# EasyEDA Pro project PRJ_Feeder_V01c.epro, schematic Feeder

## Sheets
1 MCU: Board Name: Feeder; Create Date: 2025-04-08; Page Name: MCU; Project Name: Orion-Feeder; Schematic Name: Feeder; Update Date: 2025-04-08; Company: EasyEDA.com; Drawn: Cesarotto G.; Page Size: A4; Version: V0.2a
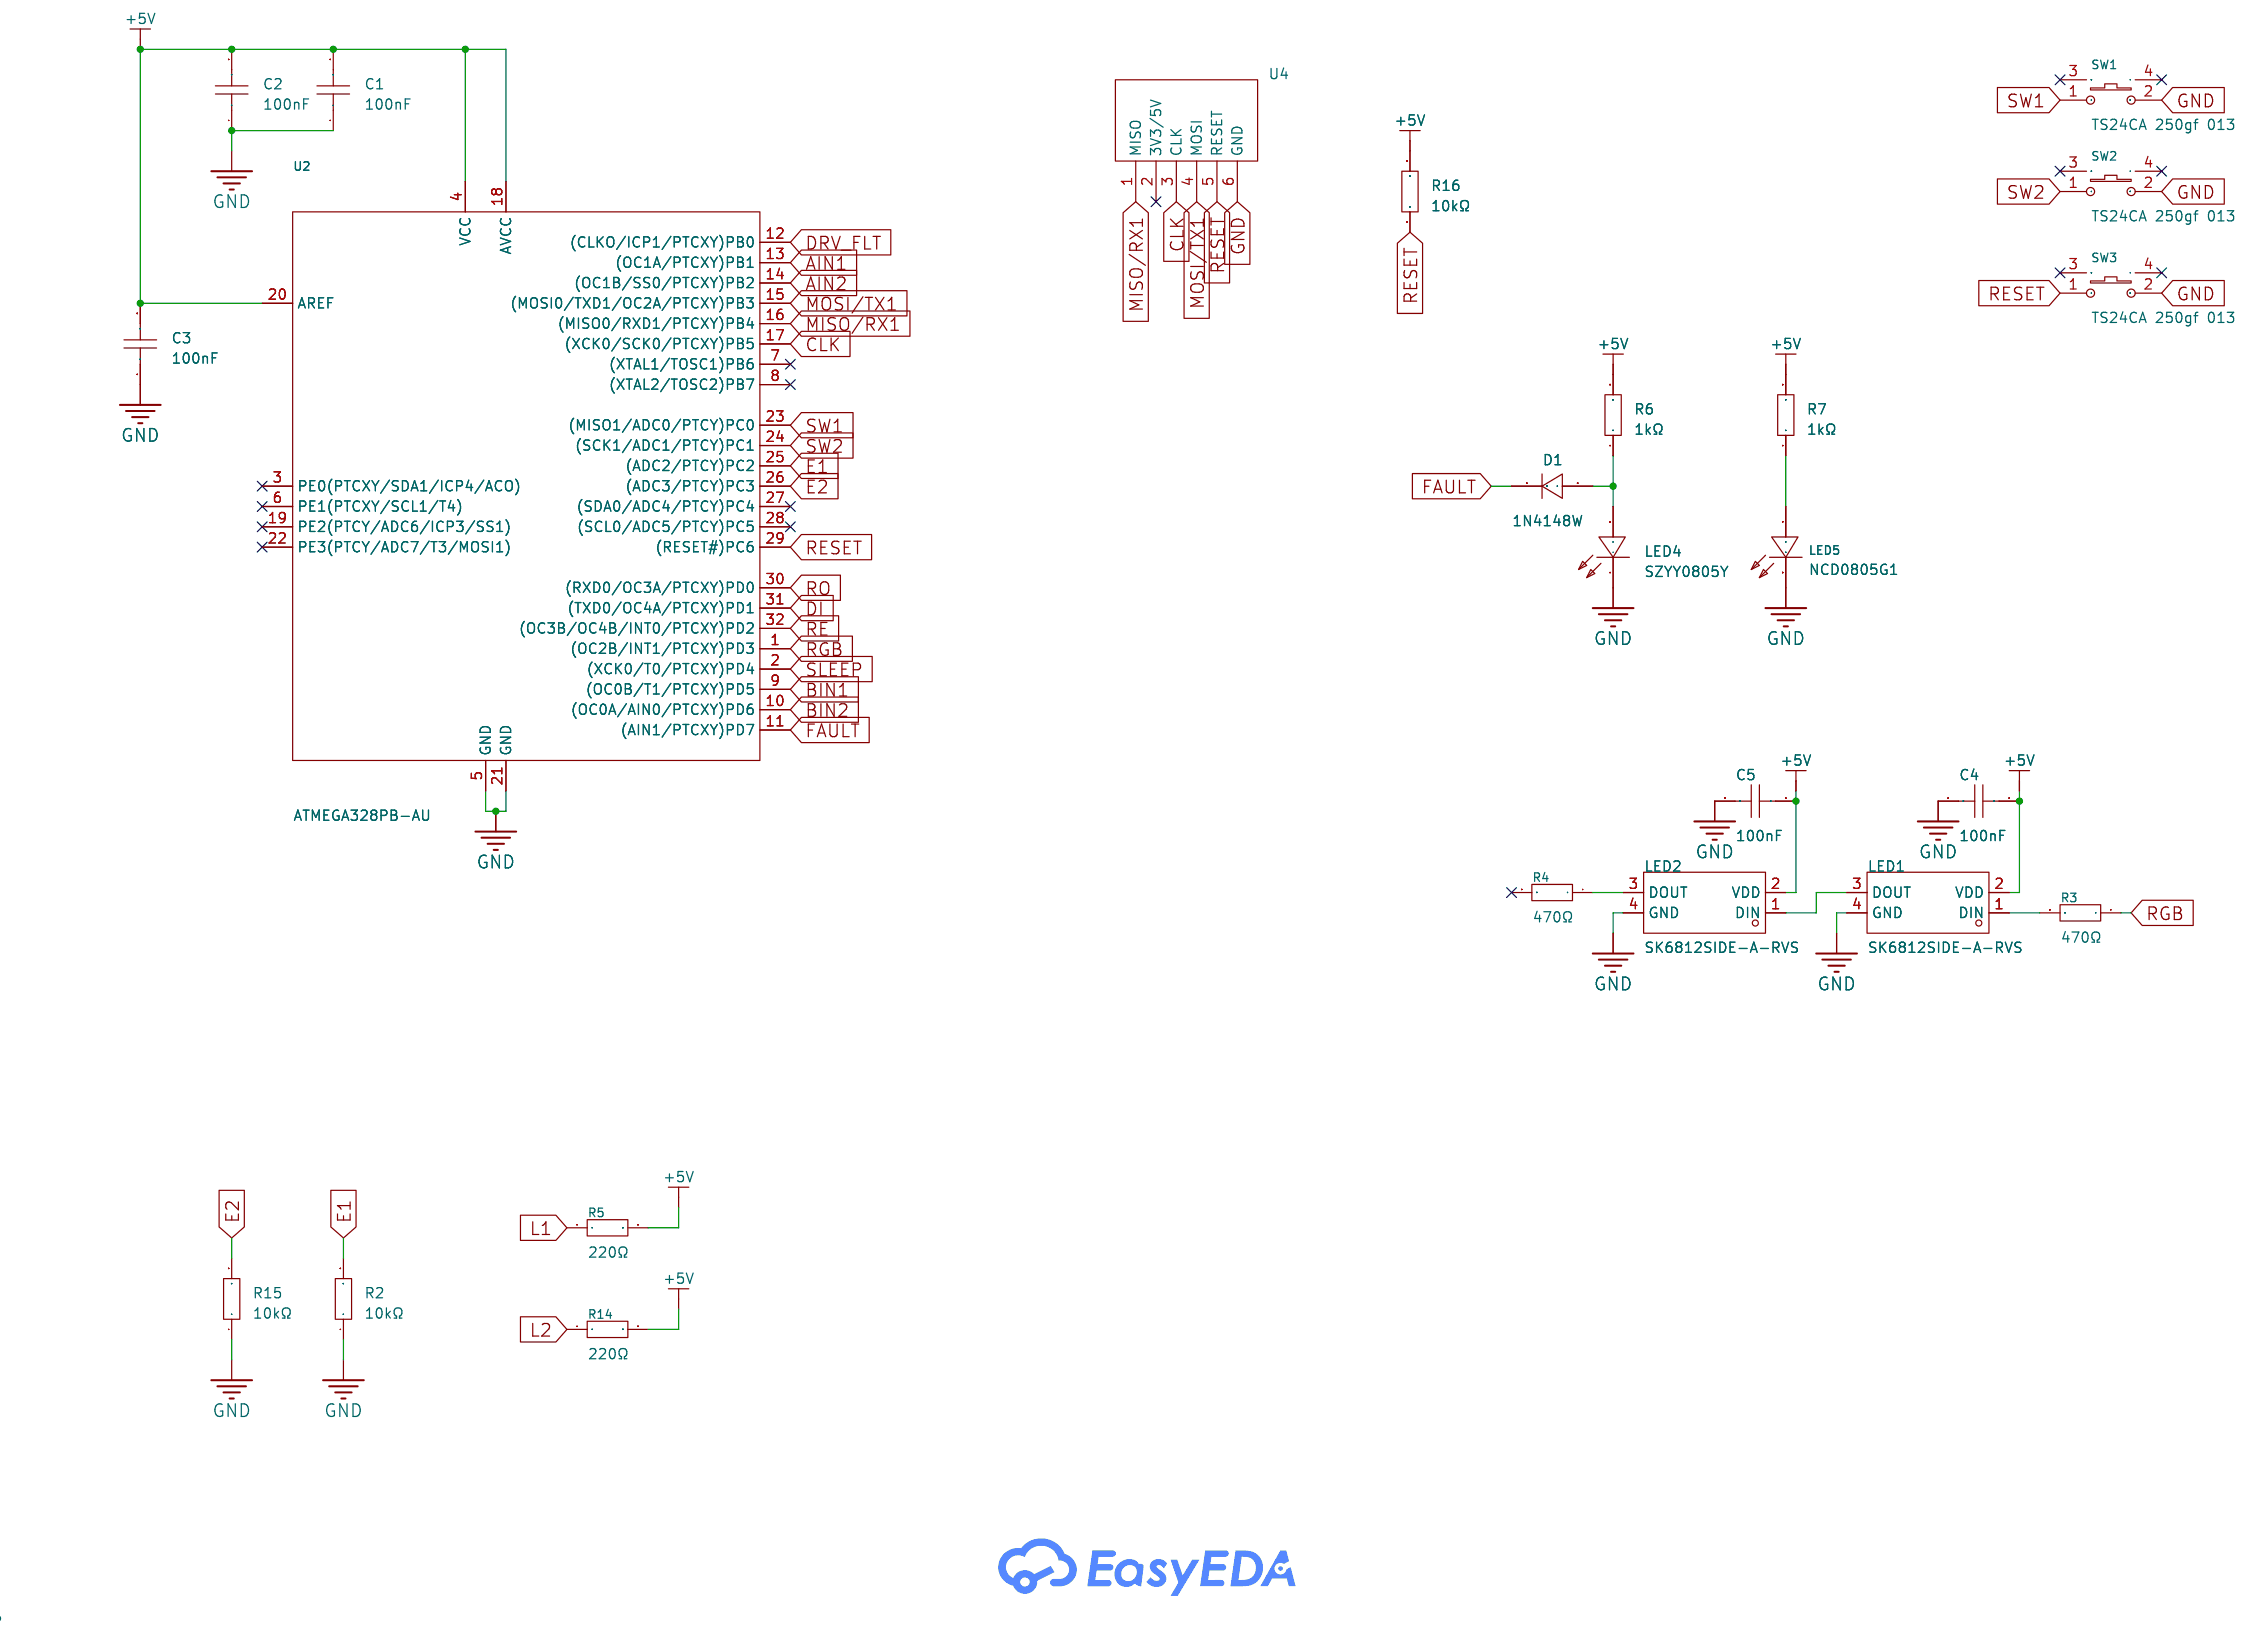
[diagram p5: MCU]
2 Power: Page Name: Power
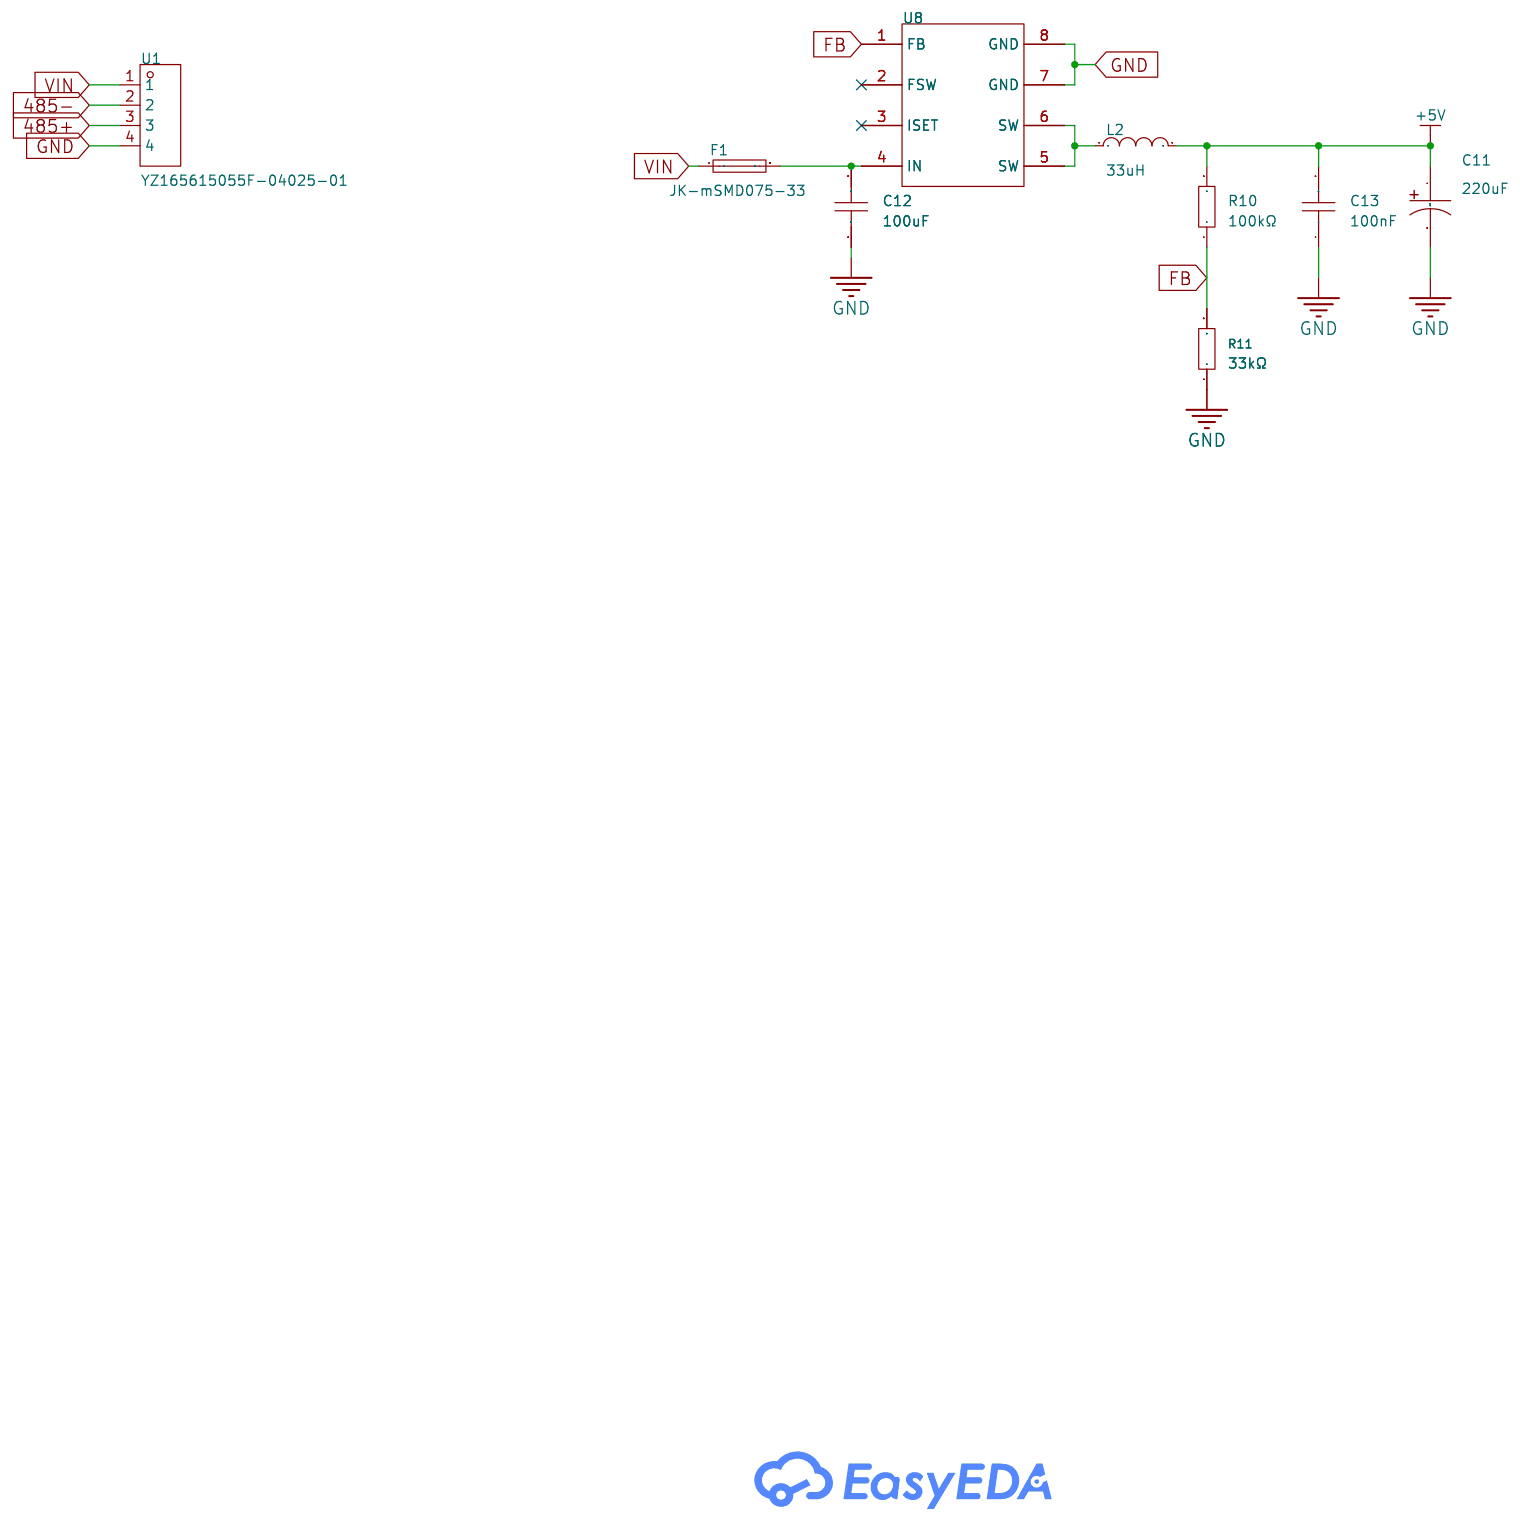
[diagram p6: Power]
3 Motor: Page Name: Motor; Update Date: 2025-04-09
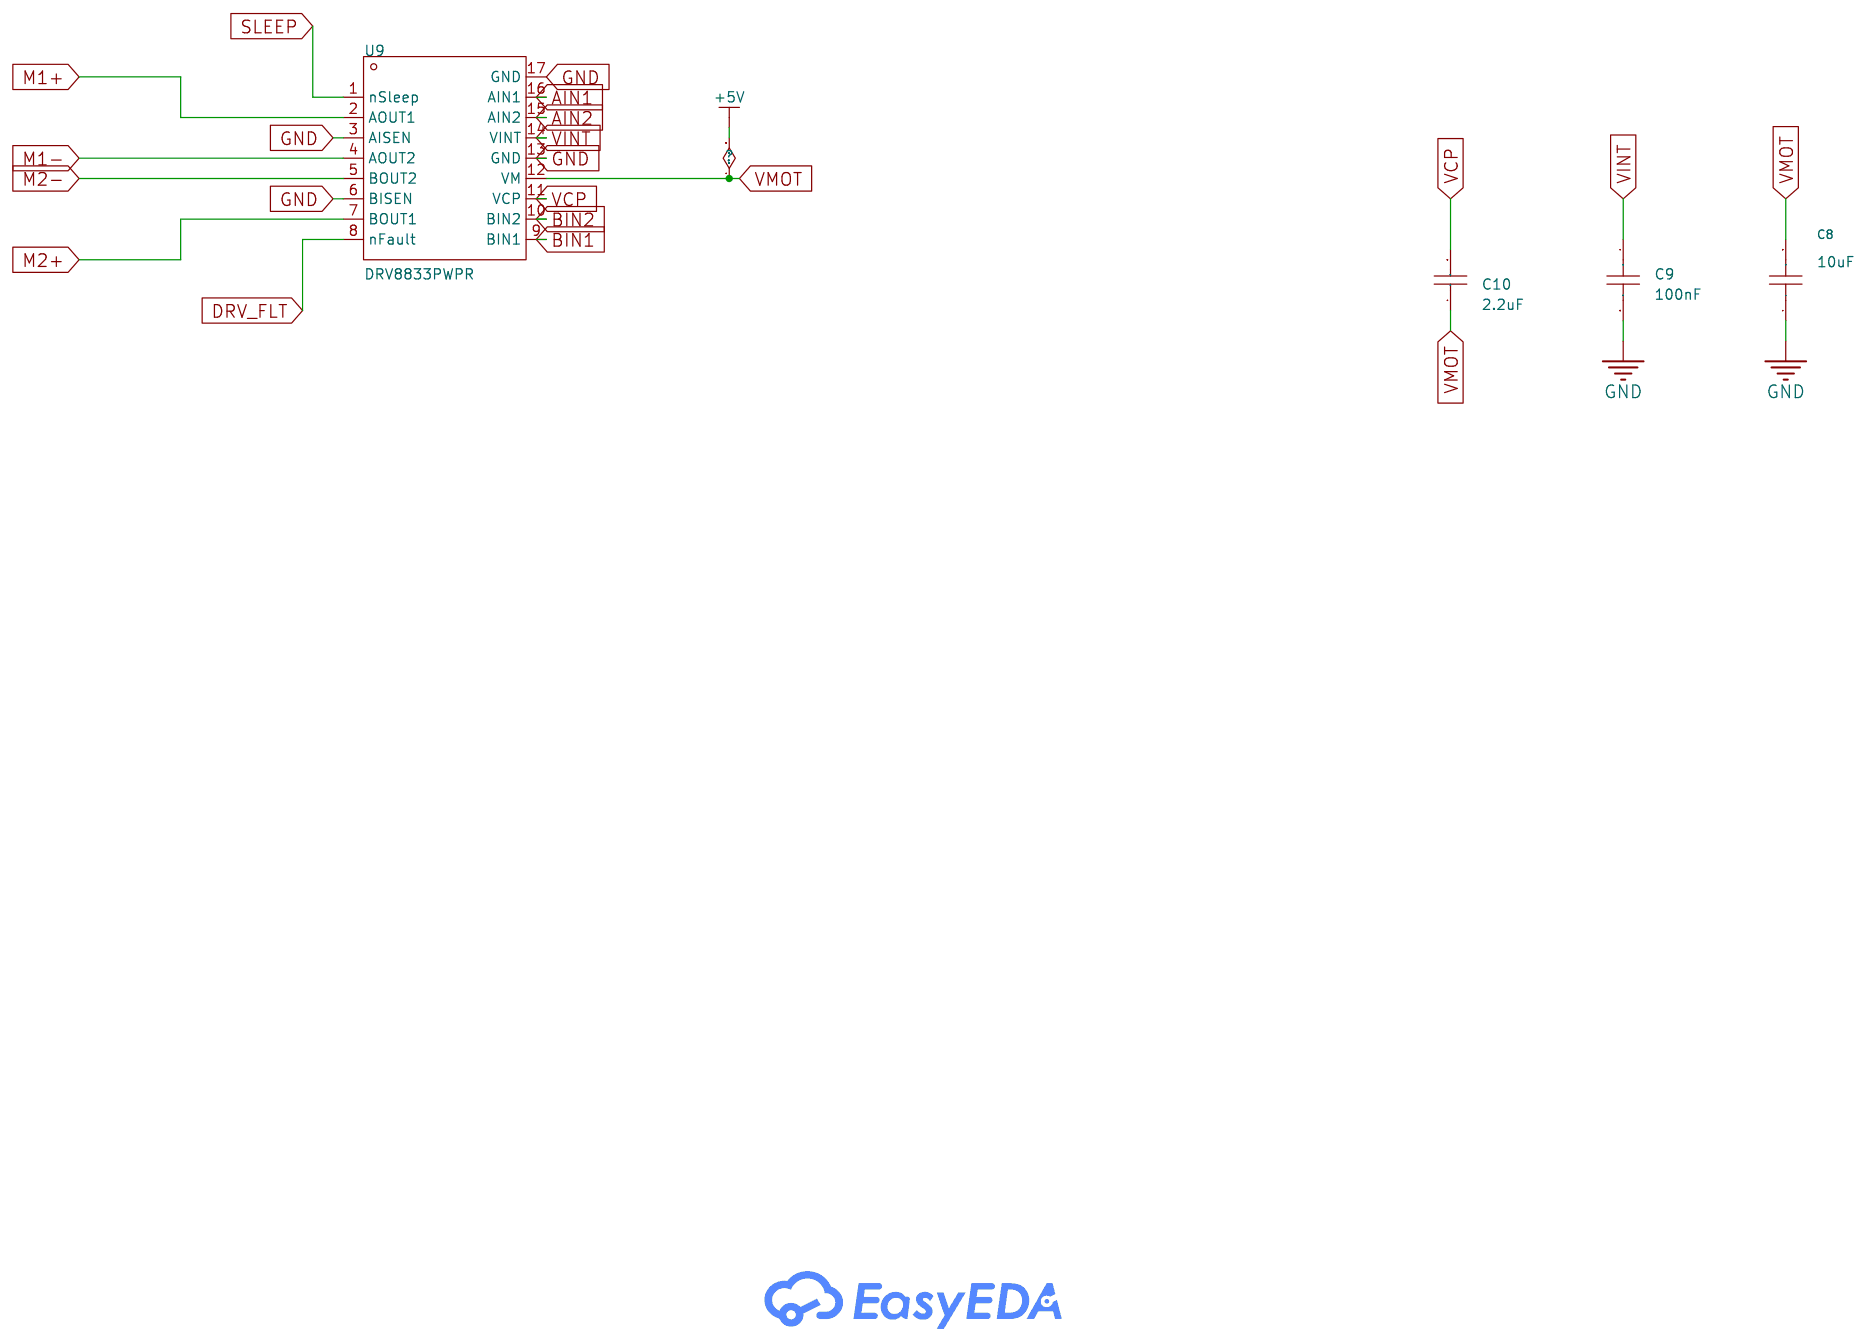
[diagram p7: Motor]
4 Serial: Page Name: Serial; Update Date: 2025-04-15; Version: V0.2b
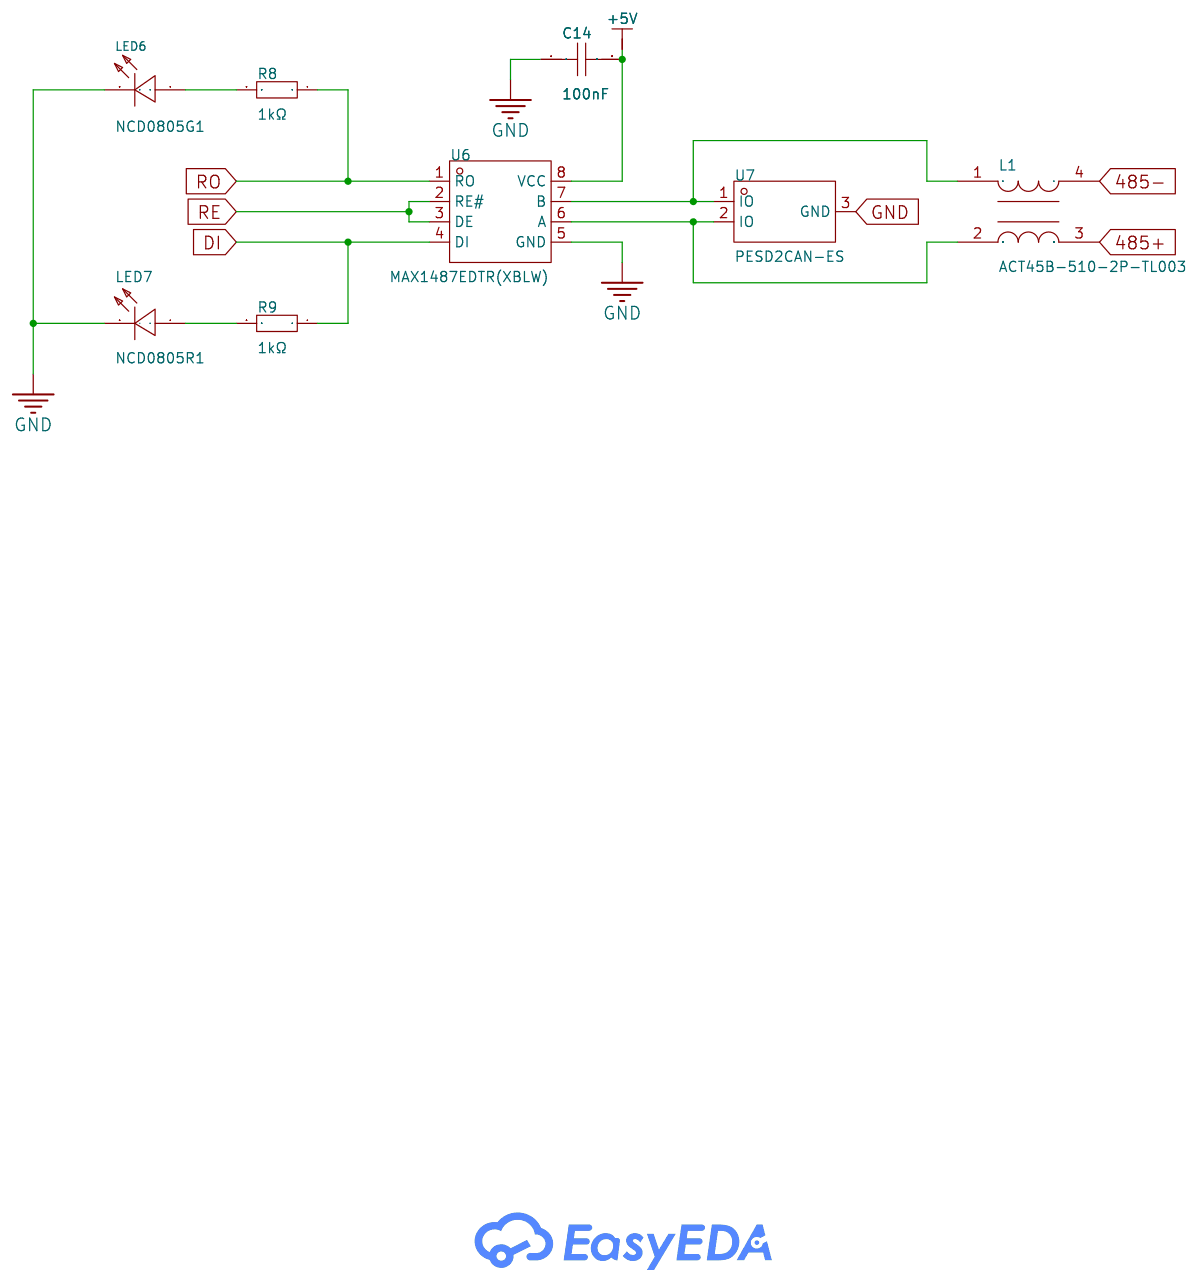
[diagram p8: Serial]

## Parts
sheet MCU
C1  100nF  [C0805]
C2  100nF  [C0805]
C3  100nF  [C0805]
C4  100nF  [C0805]
C5  100nF  [C0805]
D1  1N4148W  [SOD-123_L2.8-W1.8-LS3.7-RD]
LED1  SK6812SIDE-A-RVS  [LED-SMD_4P-L4.0-W1.6-L]
LED2  SK6812SIDE-A-RVS  [LED-SMD_4P-L4.0-W1.6-L]
LED4  SZYY0805Y  [LED0805-RD_YELLOW]
LED5  NCD0805G1  [LED0805-R-RD]
R2  10kΩ  [R0805]
R3  470Ω  [R0805]
R4  470Ω  [R0805]
R5  220Ω  [R0805]
R6  1kΩ  [R0805]
R7  1kΩ  [R0805]
R14  220Ω  [R0805]
R15  10kΩ  [R0805]
R16  10kΩ  [R0805]
SW1  TS24CA 250gf 013  [SW-SMD_L4.7-W3.5-P3.35-EH]
SW2  TS24CA 250gf 013  [SW-SMD_L4.7-W3.5-P3.35-EH]
SW3  TS24CA 250gf 013  [SW-SMD_L4.7-W3.5-P3.35-EH]
U2  ATMEGA328PB-AU  [TQFP-32_L7.0-W7.0-P0.80-LS9.0-BL]
U4  -  [HDR-M-2.54_1X6]
sheet Motor
C8  10uF  [C0805]
C9  100nF  [C0805]
C10  2.2uF  [C0805]
U9  DRV8833PWPR  [TSSOP-16_L5.0-W4.4-P0.65-LS6.4-BL-EP]
sheet Power
C11  220uF  [CAP-SMD_L7.3-W4.3-FD]
C12  100uF  [C1210]
C13  100nF  [C0805]
F1  JK-mSMD075-33  [F1812]
L2  33uH  [IND-SMD_L7.1-W6.6_SRP6030VA]
R10  100kΩ  [R0805_NEW]
R11  33kΩ  [R0805]
U1  YZ165615055F-04025-01  [CONN-SMD_4P-L11.0-W5.5-P2.50_YZ165615055F-04025-01]
U8  -  [SOP-8_L4.9-W3.9-P1.27-LS6.0-TR]
sheet Serial
C14  100nF  [C0805]
L1  ACT45B-510-2P-TL003  [IND-SMD_4P-L4.5-W3.2-TL]
LED6  NCD0805G1  [LED0805-R-RD]
LED7  NCD0805R1  [LED0805-R-RD]
R8  1kΩ  [R0805]
R9  1kΩ  [R0805]
U6  MAX1487EDTR(XBLW)  [SOP-8_L4.9-W3.9-P1.27-LS6.0-BL]
U7  PESD2CAN-ES  [SOT-23-3_L2.9-W1.3-P1.90-LS2.4-BR]

## Library data of the parts
C1-C5 C9 C13 C14 = CC0805KRX7R9BB104: Capacitance: Tolerance:±10% Tolerance:±10% Voltage Rated: Temperature Coefficient:; LCSC Part Name: 100nF ±10% 50V; Supplier Part: C49678; Manufacturer: YAGEO(国巨); Supplier Footprint: 0805; JLCPCB Part Class: Basic Part; Datasheet: https://atta.szlcsc.com/upload/public/pdf/source/20180224/C181747_15194369449651363981.pdf; Supplier: LCSC; Tolerance: ±10%
D1 = 1N4148W_C84367: Diode Configuration: Forward Voltage (Vf@If):1.5V@300mA Reverse Voltage (Vr): Rectified Current: Reverse Leakage Current:25nA@20V Reverse Recovery Time (trr): Operating Temperature:- Operating Temperature:-; LCSC Part Name: 电压:100V 电流:300mA; Supplier Part: C84367; Manufacturer: MDD(辰达半导体); Supplier Footprint: SOD-123; JLCPCB Part Class: Extended Part; Datasheet: https://atta.szlcsc.com/upload/public/pdf/source/20230823/B01BF36E6140A0359364F9F682D146D6.pdf; Supplier: LCSC; Forward Voltage (Vf@If): 1.5V@300mA; Reverse Leakage Current: 25nA@20V
LED1 LED2 = SK6812SIDE-A-RVS: LCSC Part Name: RGB三色; Supplier Part: C2890037; Manufacturer: 欧思科光电; Supplier Footprint: SMD,2x4mm; JLCPCB Part Class: Extended Part; Datasheet: https://atta.szlcsc.com/upload/public/pdf/source/20210825/5EE39C41748E35606331A2C5A4C913B6.pdf; Supplier: LCSC
LED4 = SZYY0805Y: Emitted Color:Yellow Power Dissipation:40mW Forward Current:10mA Dominant Wavelength:584nm~594nm Dominant Wavelength:584nm~594nm Peak Wavelength:596nm Diode Configuration:- Lens Color:无色透明透镜 Color Temperature:- Color Temperature:- Viewing Angle:120° Mount; LCSC Part Name: 黄灯; Supplier Part: C434436; Manufacturer: yongyu(永裕光电); Supplier Footprint: 0805; JLCPCB Part Class: Extended Part; Datasheet: https://atta.szlcsc.com/upload/public/pdf/source/20191204/C434436_DD3F69F670EA5C3EF8F92D3BC1EA8D03.pdf; Supplier: LCSC; Emitted Color: Yellow; Power Dissipation: 40mW; Forward Current: 10mA; Dominant Wavelength: 584nm~594nm; Peak Wavelength: 596nm; Lens Color: 无色透明透镜; Viewing Angle: 120°; Operating Temperature: -40℃~+85℃
LED5 LED6 = NCD0805G1: Emitted Color:Emerald Forward Voltage (VF):2.5V~3.6V Forward Voltage (VF):2.5V~3.6V Power Dissipation:72mW Forward Current:5mA Dominant Wavelength:525nm~537.5nm Dominant Wavelength:525nm~537.5nm Lens Color:无色透明透镜 Luminous Intensity:180mcd~400mcd Luminous; Supplier Part: C84260; Manufacturer: 国星光电; Supplier Footprint: 0805; JLCPCB Part Class: Extended Part; Datasheet: https://atta.szlcsc.com/upload/public/pdf/source/20200820/C84260_AFC7BF57C6FBA034D182BB8D10A67EFE.pdf; Supplier: LCSC; Emitted Color: Emerald; Forward Voltage (VF): 2.5V~3.6V; Power Dissipation: 72mW; Forward Current: 5mA; Dominant Wavelength: 525nm~537.5nm; Lens Color: 无色透明透镜; Luminous Intensity: 180mcd~400mcd; Viewing Angle: 130°; Operating Temperature: -30℃~+85℃
R2 R15 R16 = 0805W8F1002T5E: Type:Thick Film Resistors Resistance:10kΩ Tolerance:±1% Tolerance:±1% Power(Watts): Overload Voltage (Max): Temperature Coefficient:±100ppm/℃ Temperature Coefficient:±100ppm/℃ Operating Temperature Range:-55℃~+155℃ Operating Temperature Range:-55℃~+155℃; LCSC Part Name: 10kΩ ±1% 125mW 厚膜电阻; Supplier Part: C17414; Manufacturer: UNI-ROYAL(厚声); Supplier Footprint: 0805; JLCPCB Part Class: Basic Part; Datasheet: https://atta.szlcsc.com/upload/public/pdf/source/20200306/C422600_1E6D84923E4A46A82E41ADD87F860B5C.pdf; Supplier: LCSC; Type: Thick Film Resistors; Tolerance: ±1%; Temperature Coefficient: ±100ppm/℃; Operating Temperature Range: -55℃~+155℃
R3 R4 = 0805W8F4700T5E: Type:Thick Film Resistors Resistance: Tolerance:±1% Tolerance:±1% Power(Watts): Overload Voltage (Max): Temperature Coefficient:±100ppm/℃ Temperature Coefficient:±100ppm/℃ Operating Temperature Range:-55℃~+155℃ Operating Temperature Range:-55℃~+155℃; LCSC Part Name: 470Ω ±1% 125mW 厚膜电阻; Supplier Part: C17710; Manufacturer: UNI-ROYAL(厚声); Supplier Footprint: 0805; JLCPCB Part Class: Basic Part; Datasheet: https://atta.szlcsc.com/upload/public/pdf/source/20200306/C422600_1E6D84923E4A46A82E41ADD87F860B5C.pdf; Supplier: LCSC; Type: Thick Film Resistors; Tolerance: ±1%; Temperature Coefficient: ±100ppm/℃; Operating Temperature Range: -55℃~+155℃
R5 R14 = 0805W8F2200T5E: Type:Thick Film Resistors Resistance: Tolerance:±1% Tolerance:±1% Power(Watts): Overload Voltage (Max): Temperature Coefficient:±100ppm/℃ Temperature Coefficient:±100ppm/℃ Operating Temperature Range:-55℃~+155℃ Operating Temperature Range:-55℃~+155℃; LCSC Part Name: 220Ω ±1% 125mW 厚膜电阻; Supplier Part: C17557; Manufacturer: UNI-ROYAL(厚声); Supplier Footprint: 0805; JLCPCB Part Class: Basic Part; Datasheet: https://atta.szlcsc.com/upload/public/pdf/source/20200306/C422600_1E6D84923E4A46A82E41ADD87F860B5C.pdf; Supplier: LCSC; Type: Thick Film Resistors; Tolerance: ±1%; Temperature Coefficient: ±100ppm/℃; Operating Temperature Range: -55℃~+155℃
R6-R9 = 0805W8F1001T5E: Type:Thick Film Resistors Resistance:1kΩ Tolerance:±1% Tolerance:±1% Power(Watts): Overload Voltage (Max): Temperature Coefficient:±100ppm/℃ Temperature Coefficient:±100ppm/℃ Operating Temperature Range:-55℃~+155℃ Operating Temperature Range:-55℃~+155℃; LCSC Part Name: 1kΩ ±1% 125mW 厚膜电阻; Supplier Part: C17513; Manufacturer: UNI-ROYAL(厚声); Supplier Footprint: 0805; JLCPCB Part Class: Basic Part; Datasheet: https://atta.szlcsc.com/upload/public/pdf/source/20200306/C422600_1E6D84923E4A46A82E41ADD87F860B5C.pdf; Supplier: LCSC; Type: Thick Film Resistors; Tolerance: ±1%; Temperature Coefficient: ±100ppm/℃; Operating Temperature Range: -55℃~+155℃
SW1-SW3 = TS24CA 250gf 013: Circuit:SPST Actuator Style:Rectangle button Operating Force:250gf Mounting Style:卧贴 Switch Length:4.55mm Switch Width:1.8mm Switch Height:3.5mm Strike Gundam:不带 Contact Current:50mA Voltage Rating (AC):- Voltage Rating (DC):12V Power Rating:0.6W Insulati; LCSC Part Name: 2*4*3.5mm半包小贝贝TS-018小侧按键m165蓝牙耳机开关 250gf; Supplier Part: C5373430; Manufacturer: SHOU HAN(首韩); Supplier Footprint: SMD; JLCPCB Part Class: Extended Part; Datasheet: https://atta.szlcsc.com/upload/public/pdf/source/20230321/913029B0FB0CD391AF5EFD51697D8EC4.pdf; Supplier: LCSC; Circuit: SPST; Actuator Style: Rectangle button; Operating Force: 250gf; Mounting Style: 卧贴; Switch Length: 4.55mm; Switch Width: 1.8mm; Switch Height: 3.5mm; Strike Gundam: 不带; Contact Current: 50mA; Voltage Rating (DC): 12V; Power Rating: 0.6W; Insulation Resistance: 100MΩ; Actuator/Cap Color: Black; With Lamp: No; Mechanical Life: 3万次; Operating Temperature: -40℃~+85℃
U2 = ATMEGA328PB-AU: CPU Core:AVR Program Storage Size:32KB RAM Size:2KB GPIO Ports Number:27 Operating Voltage Range:1.8V~5.5V Operating Voltage Range:1.8V~5.5V CPU Maximum Speed:20MHz Program Memory Type:FLASH Operating Temperature Range:-40℃~+85℃ Operating Temperature Rang; Supplier Part: C132230; Manufacturer: MICROCHIP(美国微芯); Supplier Footprint: TQFP-32(7x7); JLCPCB Part Class: Extended Part; Datasheet: https://atta.szlcsc.com/upload/public/pdf/source/20180613/C194192_8D5429A154CB618E2C039489BC28712B.pdf; Supplier: LCSC; CPU Core: AVR; Program Storage Size: 32KB; RAM Size: 2KB; GPIO Ports Number: 27; Operating Voltage Range: 1.8V~5.5V; CPU Maximum Speed: 20MHz; Program Memory Type: FLASH; Operating Temperature Range: -40℃~+85℃; ADC (Bit): 10bit; Watchdog: 有; Low-Voltage Detect: 有; Internal Oscillator: 有
U4 = ICSP_HEADER_CUST
C8 = JMK212BJ106KD-T: Capacitance: Tolerance:±10% Tolerance:±10% Voltage Rated: Temperature Coefficient:; LCSC Part Name: 10uF ±10% 6.3V; Supplier Part: C92786; Manufacturer: TAIYO YUDEN(太诱); Supplier Footprint: 0805; JLCPCB Part Class: Extended Part; Datasheet: https://atta.szlcsc.com/upload/public/pdf/source/20210525/C2802164_C0429B055888A674C3F00BA74B841C5B.pdf; Supplier: LCSC; Tolerance: ±10%
C10 = CL21B225KOFNNNE: Capacitance: Tolerance:±10% Tolerance:±10% Voltage Rated: Temperature Coefficient:; LCSC Part Name: 2.2uF ±10% 16V; Supplier Part: C28234; Manufacturer: SAMSUNG(三星); Supplier Footprint: 0805; JLCPCB Part Class: Extended Part; Datasheet: https://atta.szlcsc.com/upload/public/pdf/source/20160218/1457707763339.pdf; Supplier: LCSC; Tolerance: ±10%
U9 = DRV8833PWPR: LCSC Part Name: 1.5A 有刷直流电机驱动芯片 10.8V; Supplier Part: C50506; Manufacturer: TI(德州仪器); Supplier Footprint: TSSOP-16-EP; JLCPCB Part Class: Extended Part; Datasheet: https://www.ti.com/cn/lit/gpn/drv8833; Supplier: LCSC
C11 = EEFCX0J221YR: Capacitance:220uF Tolerance:±20% Tolerance:±20% Voltage Rating:6.3V Ripple Current:- Equivalent Series Resistance(ESR):- Type:Polymer Pin Spacing:- Diameter:4.3mm Height - Seated (Max):7.3mm Lifetime:- Operating Temperature:-55℃~+105℃ Operating Temperatur; LCSC Part Name: 220uF ±20% 6.3V; Supplier Part: C141444; Manufacturer: PANASONIC(松下); Supplier Footprint: SMD,4.3x7.3mm; JLCPCB Part Class: Extended Part; Datasheet: https://atta.szlcsc.com/upload/public/pdf/source/20180719/C236297_CFBC4985DF33D40DC3DD938A14E4DBF3.pdf; Supplier: LCSC; Tolerance: ±20%; Voltage Rating: 6.3V; Type: Polymer; Diameter: 4.3mm; Height - Seated (Max): 7.3mm; Operating Temperature: -55℃~+105℃
C12 = MSASE32MAB5107MPNA01: Capacitance: Tolerance:±20% Tolerance:±20% Voltage Rating: Temperature Coefficient:; LCSC Part Name: EMK325ABJ107MM-P 100uF ±20% 16V; Supplier Part: C5372270; Manufacturer: TAIYO YUDEN(太诱); Supplier Footprint: 1210; JLCPCB Part Class: Extended Part; Datasheet: https://atta.szlcsc.com/upload/public/pdf/source/20230314/4A5FA4722721637CC6689D4300A86285.pdf; Supplier: LCSC; Tolerance: ±20%
F1 = JK-mSMD075-33: Voltage - Max:33V Current - Max:100A Hold Current:750mA Trip Current:1.5A Time to Trip(Max):200ms; LCSC Part Name: 33V 750mA 1812自恢复; Supplier Part: C369169; Manufacturer: JK(金科); Supplier Footprint: 1812; JLCPCB Part Class: Extended Part; Datasheet: https://atta.szlcsc.com/upload/public/pdf/source/20190306/C369179_49E64DF550FAABF10392FFAE74019A36.pdf; Supplier: LCSC; Voltage - Max: 33V; Current - Max: 100A; Hold Current: 750mA; Trip Current: 1.5A; Time to Trip(Max): 200ms
L2 = SL0630-330M: Inductance: Tolerance:±20% Tolerance:±20% Rated Current:2A Saturation Current (Isat):; LCSC Part Name: 33uH ±20% 2.5A; Supplier Part: C22463826; Manufacturer: 台湾陆海; Supplier Footprint: SMD,7.1x6.6mm; JLCPCB Part Class: Extended Part; Datasheet: https://atta.szlcsc.com/upload/public/pdf/source/20240611/8DE7D6BE1273F2E871C82A6D5C20B08D.pdf; Supplier: LCSC; Tolerance: ±20%; Rated Current: 2A
R10 = RC0805FR-07100KL: Type:Thick Film Resistors Resistance: Tolerance:±1% Tolerance:±1% Power(Watts): Overload Voltage (Max): Temperature Coefficient:±100ppm/℃ Temperature Coefficient:±100ppm/℃ Operating Temperature Range:-55℃~+155℃ Operating Temperature Range:-55℃~+155℃; LCSC Part Name: 厚膜电阻 100kΩ ±1% 125mW; Supplier Part: C96346; Manufacturer: YAGEO(国巨); Supplier Footprint: 0805; JLCPCB Part Class: Extended Part; Datasheet: https://atta.szlcsc.com/upload/public/pdf/source/20170708/1499509500945.pdf; Supplier: LCSC; Type: Thick Film Resistors; Tolerance: ±1%; Temperature Coefficient: ±100ppm/℃; Operating Temperature Range: -55℃~+155℃
R11 = 0805W8F3302T5E: Type:Thick Film Resistors Resistance:33kΩ Tolerance:±1% Tolerance:±1% Power(Watts): Overload Voltage (Max): Temperature Coefficient:±100ppm/℃ Temperature Coefficient:±100ppm/℃ Operating Temperature Range:-55℃~+155℃ Operating Temperature Range:-55℃~+155℃; LCSC Part Name: 33kΩ ±1% 125mW 厚膜电阻; Supplier Part: C17633; Manufacturer: UNI-ROYAL(厚声); Supplier Footprint: 0805; JLCPCB Part Class: Basic Part; Datasheet: https://atta.szlcsc.com/upload/public/pdf/source/20200306/C422600_1E6D84923E4A46A82E41ADD87F860B5C.pdf; Supplier: LCSC; Type: Thick Film Resistors; Tolerance: ±1%; Temperature Coefficient: ±100ppm/℃; Operating Temperature Range: -55℃~+155℃
U1 = YZ165615055F-04025-01: Type:Spring loaded pin (POGO PIN) Number of Pins:Four-PIN Bit Pitch:2.5mm Overall Length/Height:5.5mm Operational Height:4mm Contact Resistance:50mΩ Elastic Life:10000 times Rated Current:1A Rated Voltage:12V Contact Material:Brass Contact Plating:Gold Op; LCSC Part Name: 侧贴弹簧顶针连接器; Supplier Part: C5296819; Manufacturer: Xinyangze(鑫扬泽); JLCPCB Part Class: Extended Part; Datasheet: https://atta.szlcsc.com/upload/public/pdf/source/20221209/5E85F3670C782BCF645AEF457C989CF7.pdf; Supplier: LCSC; Type: Spring loaded pin (POGO PIN); Number of Pins: Four-PIN Bit; Pitch: 2.5mm; Overall Length/Height: 5.5mm; Operational Height: 4mm; Contact Resistance: 50mΩ; Elastic Life: 10000 times; Rated Current: 1A; Rated Voltage: 12V; Contact Material: Brass; Contact Plating: Gold; Operating Temperature Range: -40℃~+85℃
U8 = TMI2284Q: LCSC Part Name: C5259211
L1 = ACT45B-510-2P-TL003: Number of Lines:2 Withstanding Voltage:250V@2secs Current Rating:200mA Inductance @ Frequency:51uH@100kHz Voltage Rating - DC:50V Voltage Rating:- Impedance @ Frequency:2.8kΩ@10MHz DC Resistance (DCR):1Ω Operating Temperature:-40℃~+150℃ Operating Temperat; LCSC Part Name: 两路 4532共模滤波器 阻抗2.8kΩ@10MHz; Supplier Part: C76584; Manufacturer: TDK; Supplier Footprint: SMD,4.5x3.2mm; JLCPCB Part Class: Extended Part; Datasheet: https://atta.szlcsc.com/upload/public/pdf/source/20160918/1474166842057.pdf; Supplier: LCSC; Number of Lines: 2; Withstanding Voltage: 250V@2secs; Current Rating: 200mA; Inductance @ Frequency: 51uH@100kHz; Voltage Rating - DC: 50V; Impedance @ Frequency: 2.8kΩ@10MHz; DC Resistance (DCR): 1Ω; Operating Temperature: -40℃~+150℃
LED7 = NCD0805R1_C84256: Lamp Holder Type:- Emitted Color:Red Forward Voltage (VF):1.6V~2.6V Forward Voltage (VF):1.6V~2.6V Power Dissipation:65mW Forward Current:20mA Dominant Wavelength:615nm~630nm Dominant Wavelength:615nm~630nm Peak Wavelength:- Diode Configuration:独立二极管 Lens; Supplier Part: C84256; Manufacturer: 国星光电; Supplier Footprint: 0805; JLCPCB Part Class: Basic Part; Datasheet: https://atta.szlcsc.com/upload/public/pdf/source/20200820/C84256_F0A75A43B3EAD75808600A0514C76B99.pdf; Supplier: LCSC; Emitted Color: Red; Forward Voltage (VF): 1.6V~2.6V; Power Dissipation: 65mW; Forward Current: 20mA; Dominant Wavelength: 615nm~630nm; Diode Configuration: 独立二极管; Lens Color: 无色透明透镜; Luminous Intensity: 67mcd~195mcd; Viewing Angle: 130°; Operating Temperature: -30℃~+85℃
U6 = MAX1487EDTR(XBLW): LCSC Part Name: XBLW MAX1487 12 Mbps通信收发器; Supplier Part: C41369526; Manufacturer: XBLW(芯伯乐); Supplier Footprint: SOP-8; Datasheet: https://atta.szlcsc.com/upload/public/pdf/source/20240826/373ADB85BB75A28C97F383EDEA6A9A3C.pdf; Supplier: LCSC
U7 = PESD2CAN-ES: polarity:Bidirectional Reverse Stand-Off Voltage (Vrwm):24V Maximum Clamping Voltage:48V Peak Pulse Current (Ipp):8A Peak Pulse Power Dissipation (Ppp):450W Breakdown Voltage:26.5V Reverse Leakage Current (Ir):1uA Number of Lines:Dual channel Operating Te; LCSC Part Name: CAN 防护，两路双向ESD静电防护器件，30kV，CJ：15pF；CAN/CANFD/12V、24V电源防护; Supplier Part: C5180299; Manufacturer: ElecSuper(静芯微); Supplier Footprint: SOT-23; JLCPCB Part Class: Extended Part; Datasheet: https://atta.szlcsc.com/upload/public/pdf/source/20240905/8813EF6117DE3CA11E16DC4758DF48B3.pdf; Supplier: LCSC; polarity: Bidirectional; Reverse Stand-Off Voltage (Vrwm): 24V; Maximum Clamping Voltage: 48V; Peak Pulse Current (Ipp): 8A; Peak Pulse Power Dissipation (Ppp): 450W; Breakdown Voltage: 26.5V; Reverse Leakage Current (Ir): 1uA; Number of Lines: Dual channel; Type: ESD

## Nets
+5V: C1.2 C2.2 C3.2 C4.1 C5.1 C8.2 C10.1 C11.1 C13.2 C14.2 L2.2 LED1.2(VDD) LED2.2(VDD) R5.2 R6.2 R7.2 R10.2 R14.2 R16.2 U2.4(VCC) U2.18(AVCC) U2.20(AREF) U6.8(VCC) U9.12(VM)
GND: C1.1 C2.1 C3.1 C4.2 C5.2 C8.1 C9.2 C11.2 C12.1 C13.1 C14.1 LED1.4(GND) LED2.4(GND) LED4.1(-) LED5.2(K) LED6.2(K) LED7.2(-) R2.1 R11.1 R15.1 SW1.2 SW2.2 SW3.2 U1.4 U2.5(GND) U2.21(GND) U4.6(GND) U6.5(GND) U7.3(GND) U8.7(GND) U8.8(GND) U9.3(AISEN) U9.6(BISEN) U9.13(GND) U9.17(GND)
VIN: F1.1 U1.1
VINT: C9.1 U9.14(VINT)
485+: L1.3 U1.3
485-: L1.4 U1.2
AIN1: U2.13((OC1A/PTCXY)PB1) U9.16(AIN1)
AIN2: U2.14((OC1B/SS0/PTCXY)PB2) U9.15(AIN2)
BIN1: U2.9((OC0B/T1/PTCXY)PD5) U9.9(BIN1)
BIN2: U2.10((OC0A/AIN0/PTCXY)PD6) U9.10(BIN2)
CLK: U2.17((XCK0/SCK0/PTCXY)PB5) U4.3(CLK)
DI: R9.1 U2.31((TXD0/OC4A/PTCXY)PD1) U6.4(DI)
DRV_FLT: U2.12((CLKO/ICP1/PTCXY)PB0) U9.8(nFault)
E1: R2.2 U2.25((ADC2/PTCY)PC2)
E2: R15.2 U2.26((ADC3/PTCY)PC3)
FAULT: D1.1(C) U2.11((AIN1/PTCXY)PD7)
FB: R10.1 R11.2 U8.1(FB)
L1: R5.1
L2: R14.1
M1+: U9.2(AOUT1)
M1-: U9.4(AOUT2)
M2+: U9.7(BOUT1)
M2-: U9.5(BOUT2)
MISO/RX1: U2.16((MISO0/RXD1/PTCXY)PB4) U4.1(MISO)
MOSI/TX1: U2.15((MOSI0/TXD1/OC2A/PTCXY)PB3) U4.4(MOSI)
RE: U2.32((OC3B/OC4B/INT0/PTCXY)PD2) U6.2(RE#) U6.3(DE)
RESET: R16.1 SW3.1 U2.29((RESET#)PC6) U4.5(RESET)
RGB: R3.1 U2.1((OC2B/INT1/PTCXY)PD3)
RO: R8.1 U2.30((RXD0/OC3A/PTCXY)PD0) U6.1(RO)
SLEEP: U2.2((XCK0/T0/PTCXY)PD4) U9.1(nSleep)
SW1: SW1.1 U2.23((MISO1/ADC0/PTCY)PC0)
SW2: SW2.1 U2.24((SCK1/ADC1/PTCY)PC1)
VCP: C10.2 U9.11(VCP)
$1N1561: LED1.1(DIN) R3.2
$1N1767: LED1.3(DOUT) LED2.1(DIN)
$1N1887: LED2.3(DOUT) R4.1
$1N2907: D1.2(A) LED4.2(+) R6.1
$1N3068: LED5.1(A) R7.1
$3N396: C12.2 F1.2 U8.4(IN)
$3N943: L2.1 U8.5(SW) U8.6(SW)
$5N403: L1.1 U6.7(B) U7.1(IO)
$5N429: L1.2 U6.6(A) U7.2(IO)
$5N858: LED6.1(A) R8.2
$5N897: LED7.1(+) R9.2

Not connected (* = marked no-connect by the designer): R4 2*; SW1 3* 4*; SW2 3* 4*; SW3 3* 4*; U2 3(PE0(PTCXY/SDA1/ICP4/ACO))* 6(PE1(PTCXY/SCL1/T4))* 7((XTAL1/TOSC1)PB6)* 8((XTAL2/TOSC2)PB7)* 19(PE2(PTCY/ADC6/ICP3/SS1))* 22(PE3(PTCY/ADC7/T3/MOSI1))* 27((SDA0/ADC4/PTCY)PC4)* 28((SCL0/ADC5/PTCY)PC5)*; U4 2(3V3/5V)*; U8 2(FSW)* 3(ISET)*
